# Altium schematic sheet EMC.SchDoc: uSDR schematic
size Letter; Author: Ye-sheng Kuo; CompanyName: Univ. of Michigan; Revision: 2.0; SheetNumber: 16; SheetTotal: 16
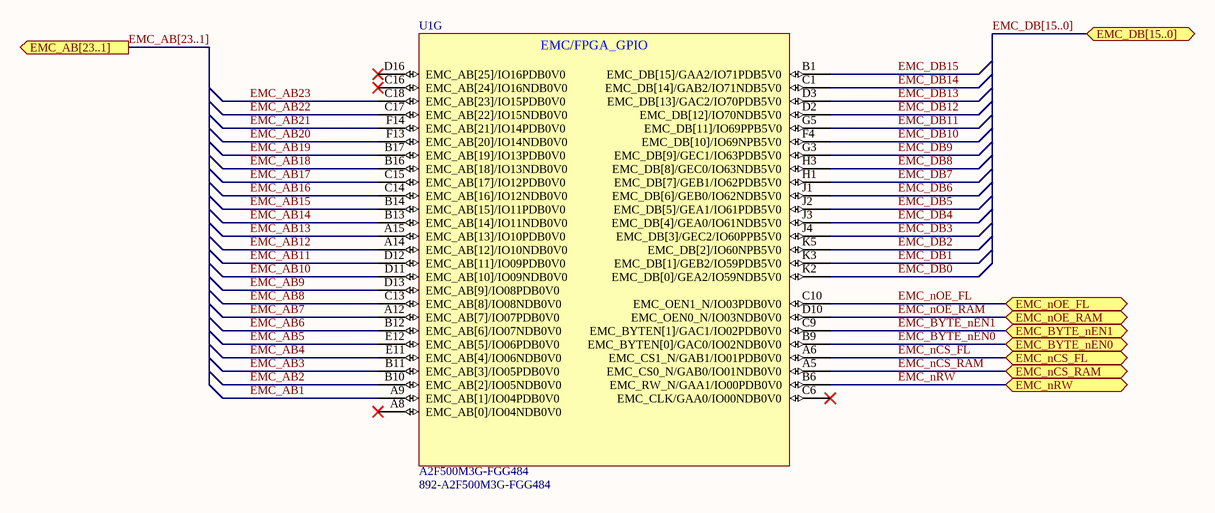
[diagram p0: EMC.SchDoc]

## Parts
U1  A2F500M3G-FGG484  Supplier Part Number 1: 892-A2F500M3G-FGG484  [BGA100P22X22-484N]  (part G of 13)

## Ports
EMC_AB[23..1] (out), EMC_BYTE_nEN0 (bidir), EMC_BYTE_nEN1 (bidir), EMC_DB[15..0] (bidir), EMC_nCS_FL (bidir), EMC_nCS_RAM (bidir), EMC_nOE_FL (bidir), EMC_nOE_RAM (bidir), EMC_nRW (bidir)

## Nets
EMC_AB1: U1.A9(EMC_AB[1]/IO04PDB0V0)
EMC_AB2: U1.B10(EMC_AB[2]/IO05NDB0V0)
EMC_AB3: U1.B11(EMC_AB[3]/IO05PDB0V0)
EMC_AB4: U1.E11(EMC_AB[4]/IO06NDB0V0)
EMC_AB5: U1.E12(EMC_AB[5]/IO06PDB0V0)
EMC_AB6: U1.B12(EMC_AB[6]/IO07NDB0V0)
EMC_AB7: U1.A12(EMC_AB[7]/IO07PDB0V0)
EMC_AB8: U1.C13(EMC_AB[8]/IO08NDB0V0)
EMC_AB9: U1.D13(EMC_AB[9]/IO08PDB0V0)
EMC_AB10: U1.D11(EMC_AB[10]/IO09NDB0V0)
EMC_AB11: U1.D12(EMC_AB[11]/IO09PDB0V0)
EMC_AB12: U1.A14(EMC_AB[12]/IO10NDB0V0)
EMC_AB13: U1.A15(EMC_AB[13]/IO10PDB0V0)
EMC_AB14: U1.B13(EMC_AB[14]/IO11NDB0V0)
EMC_AB15: U1.B14(EMC_AB[15]/IO11PDB0V0)
EMC_AB16: U1.C14(EMC_AB[16]/IO12NDB0V0)
EMC_AB17: U1.C15(EMC_AB[17]/IO12PDB0V0)
EMC_AB18: U1.B16(EMC_AB[18]/IO13NDB0V0)
EMC_AB19: U1.B17(EMC_AB[19]/IO13PDB0V0)
EMC_AB20: U1.F13(EMC_AB[20]/IO14NDB0V0)
EMC_AB21: U1.F14(EMC_AB[21]/IO14PDB0V0)
EMC_AB22: U1.C17(EMC_AB[22]/IO15NDB0V0)
EMC_AB23: U1.C18(EMC_AB[23]/IO15PDB0V0)
EMC_BYTE_nEN0: U1.B9(EMC_BYTEN[0]/GAC0/IO02NDB0V0) ; port EMC_BYTE_nEN0
EMC_BYTE_nEN1: U1.C9(EMC_BYTEN[1]/GAC1/IO02PDB0V0) ; port EMC_BYTE_nEN1
EMC_DB0: U1.K2(EMC_DB[0]/GEA2/IO59NDB5V0)
EMC_DB1: U1.K3(EMC_DB[1]/GEB2/IO59PDB5V0)
EMC_DB2: U1.K5(EMC_DB[2]/IO60NPB5V0)
EMC_DB3: U1.J4(EMC_DB[3]/GEC2/IO60PPB5V0)
EMC_DB4: U1.J3(EMC_DB[4]/GEA0/IO61NDB5V0)
EMC_DB5: U1.J2(EMC_DB[5]/GEA1/IO61PDB5V0)
EMC_DB6: U1.J1(EMC_DB[6]/GEB0/IO62NDB5V0)
EMC_DB7: U1.H1(EMC_DB[7]/GEB1/IO62PDB5V0)
EMC_DB8: U1.H3(EMC_DB[8]/GEC0/IO63NDB5V0)
EMC_DB9: U1.G3(EMC_DB[9]/GEC1/IO63PDB5V0)
EMC_DB10: U1.F4(EMC_DB[10]/IO69NPB5V0)
EMC_DB11: U1.G5(EMC_DB[11]/IO69PPB5V0)
EMC_DB12: U1.D2(EMC_DB[12]/IO70NDB5V0)
EMC_DB13: U1.D3(EMC_DB[13]/GAC2/IO70PDB5V0)
EMC_DB14: U1.C1(EMC_DB[14]/GAB2/IO71NDB5V0)
EMC_DB15: U1.B1(EMC_DB[15]/GAA2/IO71PDB5V0)
EMC_nCS_FL: U1.A6(EMC_CS1_N/GAB1/IO01PDB0V0) ; port EMC_nCS_FL
EMC_nCS_RAM: U1.A5(EMC_CS0_N/GAB0/IO01NDB0V0) ; port EMC_nCS_RAM
EMC_nOE_FL: U1.C10(EMC_OEN1_N/IO03PDB0V0) ; port EMC_nOE_FL
EMC_nOE_RAM: U1.D10(EMC_OEN0_N/IO03NDB0V0) ; port EMC_nOE_RAM
EMC_nRW: U1.B6(EMC_RW_N/GAA1/IO00PDB0V0) ; port EMC_nRW

Not connected (* = marked no-connect by the designer): U1 A8(EMC_AB[0]/IO04NDB0V0)* C6(EMC_CLK/GAA0/IO00NDB0V0)* C16(EMC_AB[24]/IO16NDB0V0)* D16(EMC_AB[25]/IO16PDB0V0)*

## Buses and harness runs
bus EMC_AB[23..1] = port EMC_AB[23..1]
bus EMC_DB[15..0] = port EMC_DB[15..0]

## Notes on the sheet
- Title
- Date:
- Author:
- Revision:
- Sheet
- of
- University of Michigan
- File:
- (in symbol F2-200_500-FGG484_1, part G) EMC/FPGA_GPIO

## Library data of the parts
U1 = F2-200_500-FGG484_1: FPGA - Field Programmable Gate Array 500K System Gates; PPS#: P0934R; Supplier 1: Mouser